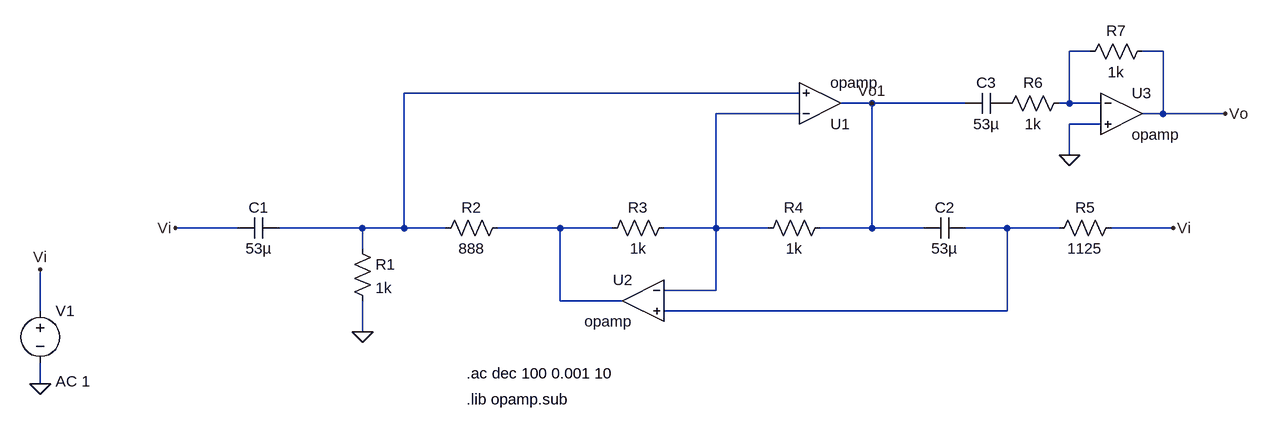
[diagram p0: schematic TS6.asc]
TS6.asc, the LTspice schematic file:
Version 4
SHEET 1 1312 680
WIRE 1024 -208 992 -208
WIRE 1136 -208 1104 -208
WIRE 576 -144 -32 -144
WIRE 688 -128 640 -128
WIRE 832 -128 688 -128
WIRE 992 -128 992 -208
WIRE 992 -128 976 -128
WIRE 1040 -128 992 -128
WIRE 576 -112 448 -112
WIRE 1136 -112 1136 -208
WIRE 1136 -112 1104 -112
WIRE 1232 -112 1136 -112
WIRE 1040 -96 992 -96
WIRE 992 -48 992 -96
WIRE -288 64 -384 64
WIRE -96 64 -224 64
WIRE -32 64 -32 -144
WIRE -32 64 -96 64
WIRE 32 64 -32 64
WIRE 208 64 112 64
WIRE 288 64 208 64
WIRE 448 64 448 -112
WIRE 448 64 368 64
WIRE 528 64 448 64
WIRE 688 64 688 -128
WIRE 688 64 608 64
WIRE 768 64 688 64
WIRE 896 64 832 64
WIRE 976 64 896 64
WIRE 1152 64 1056 64
WIRE -96 96 -96 64
WIRE 448 160 448 64
WIRE 448 160 368 160
WIRE 208 176 208 64
WIRE 304 176 208 176
WIRE -592 192 -592 128
WIRE 896 192 896 64
WIRE 896 192 368 192
WIRE -96 224 -96 176
WIRE -592 304 -592 272
FLAG -384 64 Vi
FLAG 688 -128 Vo1
FLAG 1152 64 Vi
FLAG -96 224 0
FLAG 1232 -112 Vo
FLAG 992 -48 0
FLAG -592 304 0
FLAG -592 128 Vi
SYMBOL cap -224 48 R90
WINDOW 0 0 32 VBottom 2
WINDOW 3 32 32 VTop 2
SYMATTR InstName C1
SYMATTR Value 53µ
SYMBOL res -112 80 R0
SYMATTR InstName R1
SYMATTR Value 1k
SYMBOL res 128 48 R90
WINDOW 0 0 56 VBottom 2
WINDOW 3 32 56 VTop 2
SYMATTR InstName R2
SYMATTR Value 888
SYMBOL res 384 48 R90
WINDOW 0 0 56 VBottom 2
WINDOW 3 32 56 VTop 2
SYMATTR InstName R3
SYMATTR Value 1k
SYMBOL res 624 48 R90
WINDOW 0 0 56 VBottom 2
WINDOW 3 32 56 VTop 2
SYMATTR InstName R4
SYMATTR Value 1k
SYMBOL cap 832 48 R90
WINDOW 0 0 32 VBottom 2
WINDOW 3 32 32 VTop 2
SYMATTR InstName C2
SYMATTR Value 53µ
SYMBOL res 1072 48 R90
WINDOW 0 0 56 VBottom 2
WINDOW 3 32 56 VTop 2
SYMATTR InstName R5
SYMATTR Value 1125
SYMBOL OpAmps\\opamp 608 -64 M180
SYMATTR InstName U1
SYMBOL OpAmps\\opamp 336 112 M0
SYMATTR InstName U2
SYMBOL OpAmps\\opamp 1072 -176 R0
SYMATTR InstName U3
SYMBOL cap 896 -144 R90
WINDOW 0 0 32 VBottom 2
WINDOW 3 32 32 VTop 2
SYMATTR InstName C3
SYMATTR Value 53µ
SYMBOL res 992 -144 R90
WINDOW 0 0 56 VBottom 2
WINDOW 3 32 56 VTop 2
SYMATTR InstName R6
SYMATTR Value 1k
SYMBOL res 1120 -224 R90
WINDOW 0 0 56 VBottom 2
WINDOW 3 32 56 VTop 2
SYMATTR InstName R7
SYMATTR Value 1k
SYMBOL voltage -592 176 R0
WINDOW 123 24 124 Left 2
WINDOW 39 0 0 Left 0
SYMATTR InstName V1
SYMATTR Value ""
SYMATTR Value2 AC 1
TEXT 64 288 Left 2 !.ac dec 100 0.001 10
TEXT 64 328 Left 2 !.lib opamp.sub

The netlist it stands for:
* TS6.asc
C1 N002 Vi 53µ
R1 N002 0 1k
R2 N004 N002 888
R3 N003 N004 1k
R4 Vo1 N003 1k
C2 N005 Vo1 53µ
R5 Vi N005 1125
XU1 N003 N002 Vo1 opamp Aol=100K GBW=10Meg  ; pins invin noninvin out
XU2 N003 N005 N004 opamp Aol=100K GBW=10Meg  ; pins invin noninvin out
XU3 N001 0 Vo opamp Aol=100K GBW=10Meg  ; pins invin noninvin out
C3 P001 Vo1 53µ
R6 N001 P001 1k
R7 Vo N001 1k
V1 Vi 0 AC 1
.ac dec 100 0.001 10
.lib opamp.sub
.backanno
.end